# EAGLE board TUTUPA V2.5sch (EAGLE 7.3.0)
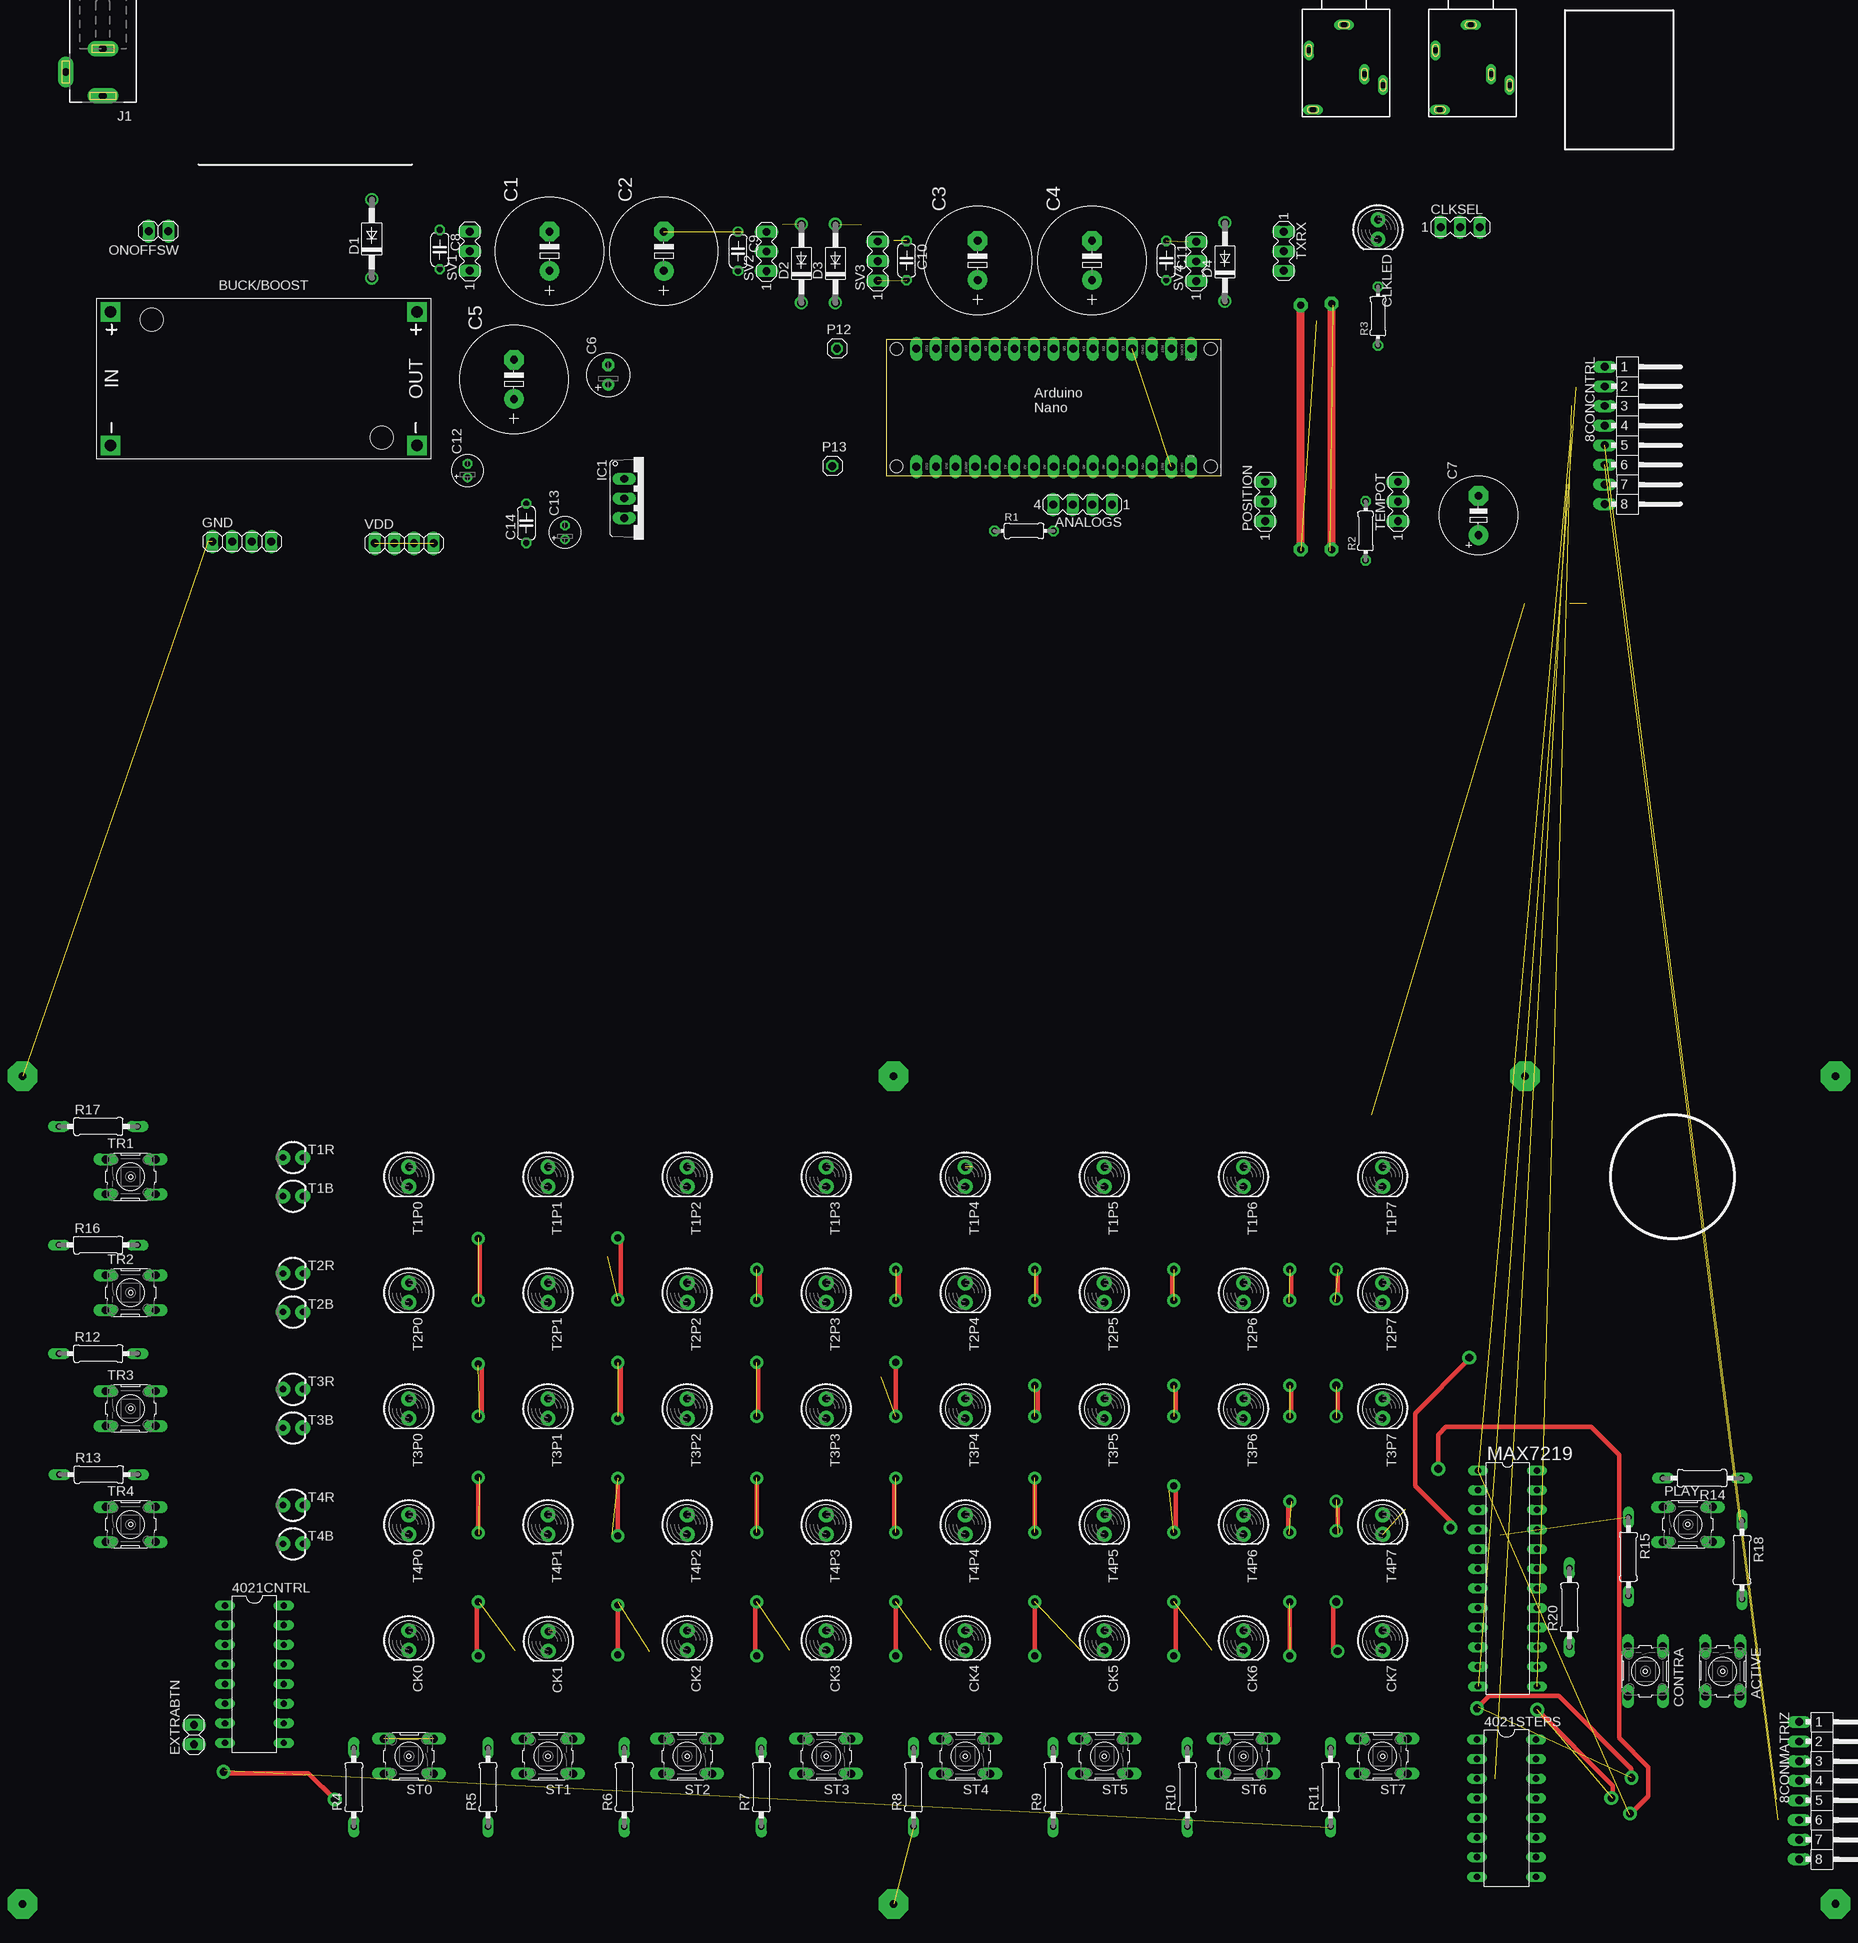
[diagram p2: board, top side]
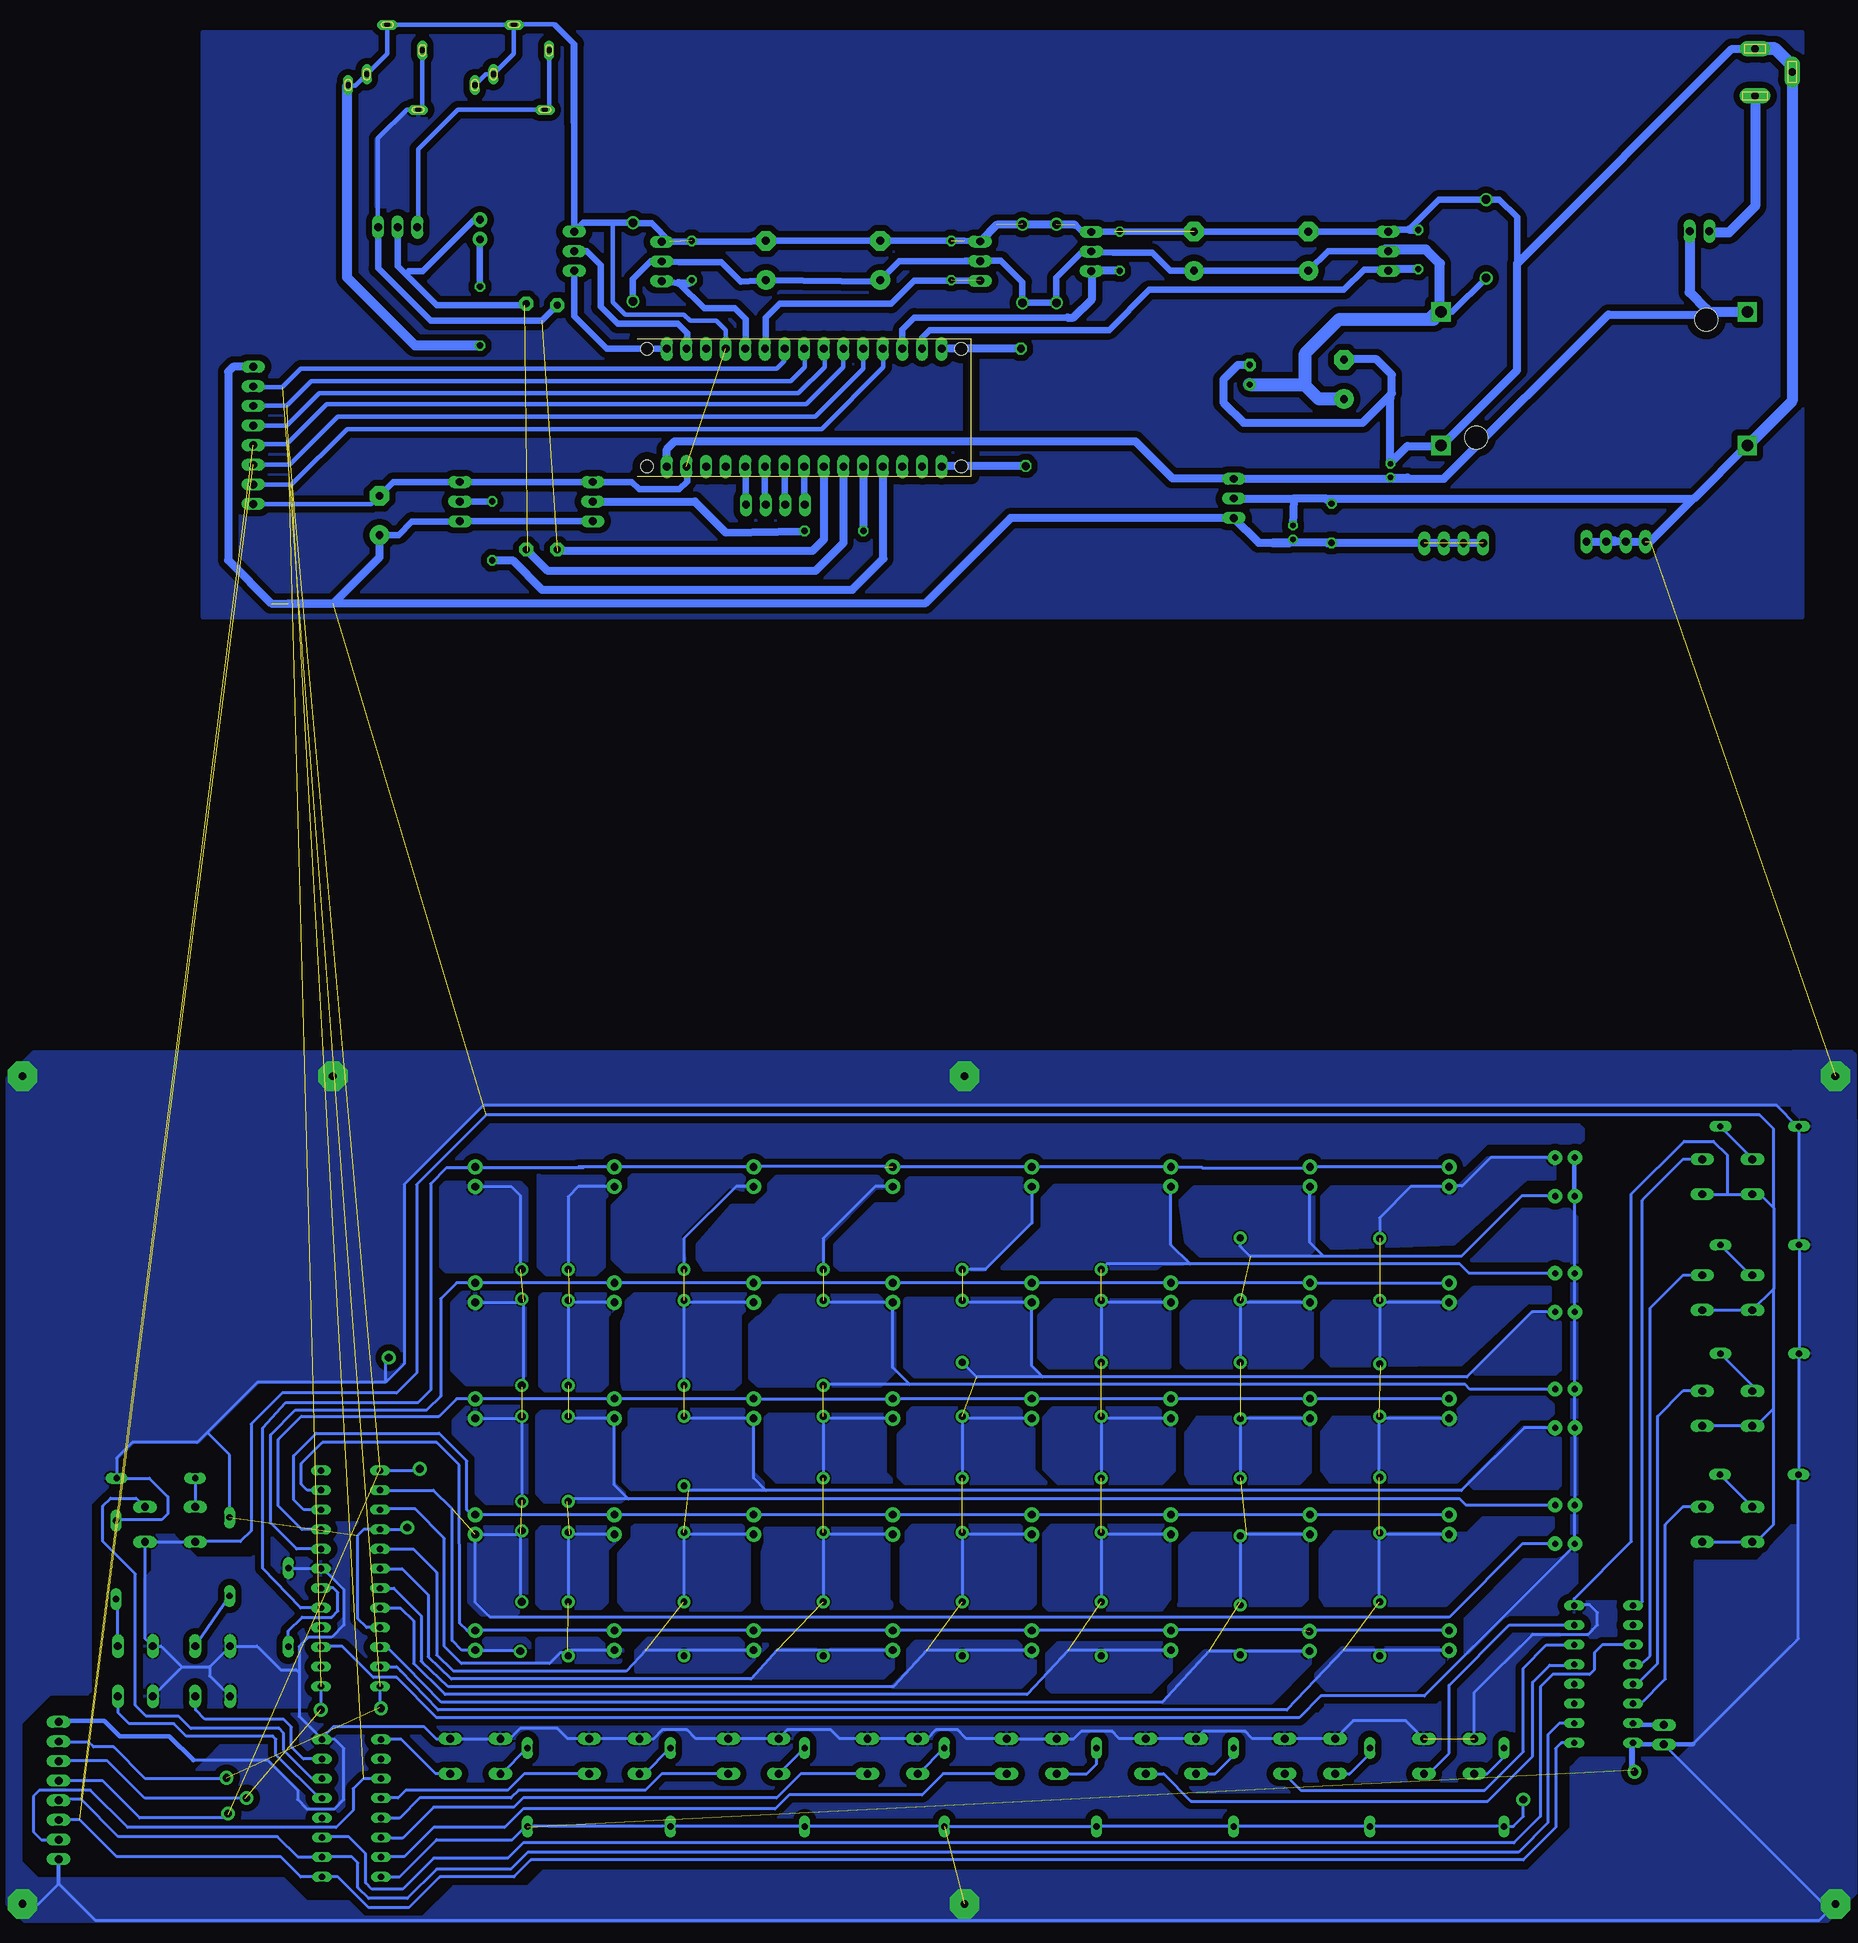
[diagram p3: board, bottom side, seen from below]

Size 43.18 x 17.78 mm. Coordinates in mm from the lower left corner, seen from the top.
Copper layers (1*16): Top 0.035mm / dielectric 1.5mm / Bottom 0.035mm
Design rules "default": minimum track width 10mil, minimum drill 24mil, track to track 8mil, track to pad 8mil, pad to pad 8mil, via to via 8mil, smd to smd 8mil, copper to edge 40mil, drill to drill 8mil, minimum pad ring 10mil, minimum via ring 8mil, stop-mask expansion 4mil, vias tented up to drill 0mil, thermal gap 10mil

## Footprints (pad centres in the part's own frame; a part is rotated, then mirrored left to right if it is on the bottom)
MA08-1W = drill 1.016 long: 1 -8.89,0; 2 -6.35,0; 3 -3.81,0; 4 -1.27,0; 5 1.27,0; 6 3.81,0; 7 6.35,0; 8 8.89,0
DIL16 = drill 0.813 long: 1 -8.89,-3.81; 2 -6.35,-3.81; 3 -3.81,-3.81; 4 -1.27,-3.81; 5 1.27,-3.81; 6 3.81,-3.81; 7 6.35,-3.81; 8 8.89,-3.81; 9 8.89,3.81; 10 6.35,3.81; 11 3.81,3.81; 12 1.27,3.81; 13 -1.27,3.81; 14 -3.81,3.81; 15 -6.35,3.81; 16 -8.89,3.81
B3F-10XX = drill 1.016 long: 1 -3.251,2.261; 2 3.251,2.261; 3 -3.251,-2.261; 4 3.251,-2.261
MA04-1 = drill 1.016 long: 1 -3.81,0; 2 -1.27,0; 3 1.27,0; 4 3.81,0
DC-DC-STEP-DOWN-LM2596 = drill 1.5 pad 2.5 square: IN+ -19.812,8.636; IN- -19.812,-8.636; OUT+ 19.812,8.636; OUT- 19.812,-8.636 | hole 3: -14.478,7.62; 15.24,-7.62
E5-13 = drill 1.016 pad 2.54: + -2.54,0 | drill 1.016 pad 2.54 octagon: - 2.54,0
E2,5-6 = drill 0.813 pad 1.6: + -1.27,0 | drill 0.813 pad 1.6 octagon: - 1.27,0
E5-10,5 = drill 1.016 pad 2.54: + -2.54,0 | drill 1.016 pad 2.54 octagon: - 2.54,0
C050-024X044 = drill 0.813 octagon: 1 -2.54,0; 2 2.54,0
E1,8-4 = drill 0.711 pad 1.168: + -0.889,0 | drill 0.711 pad 1.168 octagon: - 0.889,0
LED5MM = drill 1 pad 1.93: A -1.27,0; K 1.27,0
1503_09 = drill 0.8 pad 1.2 long: 1 0,-2.1; 2 -4.55,-5.4; 3 5.05,-9.9; 4 -4,-13.1; 5 2.65,-8.5
MA03-1 = drill 1.016 long: 1 -2.54,0; 2 0,0; 3 2.54,0
DO41-10 = drill 1.118: A 5.08,0; C -5.08,0
1X02 = drill 1.016 long: 1 -1.27,0; 2 1.27,0
1X04 = drill 1.016 long: 1 -3.81,0; 2 -1.27,0; 3 1.27,0; 4 3.81,0
TO220V = drill 1.016 long: 1 -2.54,-2.54; 2 0,-2.54; 3 2.54,-2.54
DCJ0202 = drill 1 pad 2 long: 1 0,3.1; 2 4.8,0; 3 0,-3
DIL24-3 = drill 0.813 long: 1 -13.97,-3.81; 2 -11.43,-3.81; 3 -8.89,-3.81; 4 -6.35,-3.81; 5 -3.81,-3.81; 6 -1.27,-3.81; 7 1.27,-3.81; 8 3.81,-3.81; 9 6.35,-3.81; 10 8.89,-3.81; 11 11.43,-3.81; 12 13.97,-3.81; 13 13.97,3.81; 14 11.43,3.81; 15 8.89,3.81; 16 6.35,3.81; 17 3.81,3.81; 18 1.27,3.81; 19 -1.27,3.81; 20 -3.81,3.81; 21 -6.35,3.81; 22 -8.89,3.81; 23 -11.43,3.81; 24 -13.97,3.81
1X01 = drill 1.016 octagon: 1 0,0
ARDUINO_NANO = drill 1.016 pad 1.422 long: 3V3 6.35,1.27; 5V 31.75,1.27; A0 11.43,1.27; A1 13.97,1.27; A2 16.51,1.27; A3 19.05,1.27; A4 21.59,1.27; A5 24.13,1.27; A6 26.67,1.27; A7 29.21,1.27; D2 29.21,16.51; D3 26.67,16.51; D4 24.13,16.51; D5 21.59,16.51; D6 19.05,16.51; D7 16.51,16.51; D8 13.97,16.51; D9 11.43,16.51; D10 8.89,16.51; D11 6.35,16.51; D12 3.81,16.51; D13 3.81,1.27; GND 31.75,16.51; GND. 36.83,1.27; REF 8.89,1.27; RST 34.29,16.51; RST. 34.29,1.27; RX1 36.83,16.51; TX1 39.37,16.51; VIN 39.37,1.27 | hole 1.651: 1.27,1.27; 1.27,16.51; 41.91,16.51; 41.91,1.27
0204/7 = drill 0.813 octagon: 1 -3.81,0; 2 3.81,0
0207/10 = drill 0.813 pad 1.422 long: 1 -5.08,0; 2 5.08,0
LED3MM = drill 0.813 pad 1.88: A -1.27,0; K 1.27,0

## Placement (x,y rotation side)
8CONCNTRL  [MA08-1W]  92.89,5.3 270 top  (outside the outline)
8CONMATRIZ  [MA08-1W]  118.07,-170.1 270 top  (outside the outline)
4021CNTRL  4021N  [DIL16]  -81.85,-155.04 270 top  (outside the outline)
4021STEPS  4021N  [DIL16]  80.18,-172.37 270 top  (outside the outline)
ACTIVE  [B3F-10XX]  108.15,-154.66 270 top  (outside the outline)
ANALOGS  [MA04-1]  25.32,-3.66 180 top  (outside the outline)
BUCK/BOOST  DC-DC-STEP-DOWN-LM2596  [DC-DC-STEP-DOWN-LM2596]  -80.63,12.66 0 top  (outside the outline)
C1  1000uf  [E5-13]  -43.65,29.14 90 top  (outside the outline)
C2  1000uF  [E5-13]  -28.85,29.14 90 top  (outside the outline)
C3  1000uF  [E5-13]  11.75,27.94 90 top  (outside the outline)
C4  1000uF  [E5-13]  26.55,27.94 90 top  (outside the outline)
C5  1000uF  [E5-13]  -48.25,12.54 90 top  (outside the outline)
C6  [E2,5-6]  -36.05,13.14 90 top  (outside the outline)
C7  680uF  [E5-10,5]  76.55,-5.06 90 top  (outside the outline)
C8  100nF  [C050-024X044]  -57.85,29.34 270 top  (outside the outline)
C9  100nF  [C050-024X044]  -19.25,29.14 270 top  (outside the outline)
C10  100nF  [C050-024X044]  2.55,27.94 270 top  (outside the outline)
C11  100nF  [C050-024X044]  36.15,27.94 270 top  (outside the outline)
C12  10uF  [E1,8-4]  -54.25,0.74 90 top  (outside the outline)
C13  10uF  [E1,8-4]  -41.65,-7.26 90 top  (outside the outline)
C14  100nF  [C050-024X044]  -46.65,-6.06 90 top  (outside the outline)
CK0  [LED5MM]  -61.85,-150.66 270 top  (outside the outline)
CK1  [LED5MM]  -43.79,-150.78 270 top  (outside the outline)
CK2  [LED5MM]  -25.85,-150.66 270 top  (outside the outline)
CK3  [LED5MM]  -7.85,-150.66 270 top  (outside the outline)
CK4  [LED5MM]  10.15,-150.66 270 top  (outside the outline)
CK5  [LED5MM]  28.15,-150.66 270 top  (outside the outline)
CK6  [LED5MM]  46.15,-150.66 270 top  (outside the outline)
CK7  [LED5MM]  64.15,-150.66 270 top  (outside the outline)
CLKIN  1503_09  [1503_09]  59.15,60.54 0 top  (outside the outline)
CLKLED  [LED5MM]  63.55,31.94 270 top  (outside the outline)
CLKOUT  1503_09  [1503_09]  75.55,60.54 0 top  (outside the outline)
CLKSEL  [MA03-1]  74.19,32.26 0 top  (outside the outline)
CONTRA  [B3F-10XX]  98.15,-154.66 270 top  (outside the outline)
D1  1N4004  [DO41-10]  -66.65,30.74 90 top  (outside the outline)
D2  1N4004  [DO41-10]  -11.05,27.54 90 top  (outside the outline)
D3  1N4004  [DO41-10]  -6.65,27.54 90 top  (outside the outline)
D4  1N4004  [DO41-10]  43.75,27.74 90 top  (outside the outline)
EXTRABTN  [1X02]  -89.65,-162.86 90 top  (outside the outline)
GND  [1X04]  -83.45,-8.46 0 top  (outside the outline)
IC1  7805TV  [TO220V]  -31.45,-2.86 270 top  (outside the outline)
J1  DCJ0202  [DCJ0202]  -101.45,52.34 180 top  (outside the outline)
MAX7219  MAX7219CNG  [DIL24-3]  80.31,-142.65 270 top  (outside the outline)
ONOFFSW  [1X02]  -94.25,31.74 180 top  (outside the outline)
P12  [1X01]  -6.45,16.54 0 top  (outside the outline)
P13  [1X01]  -7.05,1.34 0 top  (outside the outline)
PCB1  ARDUINO_NANO  [ARDUINO_NANO]  0,0 0 top
PLAY  [B3F-10XX]  103.65,-135.66 0 top  (outside the outline)
POSITION  [MA03-1]  48.95,-3.26 90 top  (outside the outline)
R1  220  [0204/7]  17.75,-7.06 0 top  (outside the outline)
R2  220  [0204/7]  61.95,-7.06 90 top  (outside the outline)
R3  330  [0204/7]  63.55,20.74 90 top  (outside the outline)
R4  10k  [0207/10]  -68.97,-169.66 90 top  (outside the outline)
R5  10k  [0207/10]  -51.61,-169.66 90 top  (outside the outline)
R6  10k  [0207/10]  -33.98,-169.66 90 top  (outside the outline)
R7  10k  [0207/10]  -16.24,-169.66 90 top  (outside the outline)
R8  10k  [0207/10]  3.46,-169.66 90 top  (outside the outline)
R9  10k  [0207/10]  21.53,-169.66 90 top  (outside the outline)
R10  10k  [0207/10]  38.9,-169.66 90 top  (outside the outline)
R11  10k  [0207/10]  57.41,-169.66 90 top  (outside the outline)
R12  10k  [0207/10]  -102.04,-113.55 0 top  (outside the outline)
R13  10k  [0207/10]  -101.97,-129.19 0 top  (outside the outline)
R14  10k  [0207/10]  105.48,-129.67 180 top  (outside the outline)
R15  10k  [0207/10]  95.95,-139.83 270 top  (outside the outline)
R16  10k  [0207/10]  -102.05,-99.49 0 top  (outside the outline)
R17  10k  [0207/10]  -102.03,-84.14 0 top  (outside the outline)
R18  10k  [0207/10]  110.65,-140.24 270 top  (outside the outline)
R20  10k  [0207/10]  88.33,-146.4 90 top  (outside the outline)
ST0  [B3F-10XX]  -61.85,-165.66 180 top  (outside the outline)
ST1  [B3F-10XX]  -43.85,-165.66 180 top  (outside the outline)
ST2  [B3F-10XX]  -25.85,-165.66 180 top  (outside the outline)
ST3  [B3F-10XX]  -7.85,-165.66 180 top  (outside the outline)
ST4  [B3F-10XX]  10.15,-165.66 180 top  (outside the outline)
ST5  [B3F-10XX]  28.15,-165.66 180 top  (outside the outline)
ST6  [B3F-10XX]  46.15,-165.66 180 top  (outside the outline)
ST7  [B3F-10XX]  64.15,-165.66 180 top  (outside the outline)
SV1  [MA03-1]  -53.97,29.14 90 top  (outside the outline)
SV2  [MA03-1]  -15.57,29.1 90 top  (outside the outline)
SV3  [MA03-1]  -1.17,27.86 90 top  (outside the outline)
SV4  [MA03-1]  40.03,27.82 90 top  (outside the outline)
T1B  [LED3MM]  -76.85,-93.16 0 top  (outside the outline)
T1P0  [LED5MM]  -61.85,-90.66 270 top  (outside the outline)
T1P1  [LED5MM]  -43.85,-90.66 270 top  (outside the outline)
T1P2  [LED5MM]  -25.85,-90.66 270 top  (outside the outline)
T1P3  [LED5MM]  -7.85,-90.66 270 top  (outside the outline)
T1P4  [LED5MM]  10.15,-90.66 270 top  (outside the outline)
T1P5  [LED5MM]  28.15,-90.66 270 top  (outside the outline)
T1P6  [LED5MM]  46.15,-90.66 270 top  (outside the outline)
T1P7  [LED5MM]  64.15,-90.66 270 top  (outside the outline)
T1R  [LED3MM]  -76.85,-88.16 0 top  (outside the outline)
T2B  [LED3MM]  -76.85,-108.16 0 top  (outside the outline)
T2P0  [LED5MM]  -61.85,-105.66 270 top  (outside the outline)
T2P1  [LED5MM]  -43.85,-105.66 270 top  (outside the outline)
T2P2  [LED5MM]  -25.85,-105.66 270 top  (outside the outline)
T2P3  [LED5MM]  -7.85,-105.66 270 top  (outside the outline)
T2P4  [LED5MM]  10.15,-105.66 270 top  (outside the outline)
T2P5  [LED5MM]  28.15,-105.66 270 top  (outside the outline)
T2P6  [LED5MM]  46.15,-105.66 270 top  (outside the outline)
T2P7  [LED5MM]  64.15,-105.66 270 top  (outside the outline)
T2R  [LED3MM]  -76.85,-103.16 0 top  (outside the outline)
T3B  [LED3MM]  -76.85,-123.16 0 top  (outside the outline)
T3P0  [LED5MM]  -61.85,-120.66 270 top  (outside the outline)
T3P1  [LED5MM]  -43.85,-120.66 270 top  (outside the outline)
T3P2  [LED5MM]  -25.85,-120.66 270 top  (outside the outline)
T3P3  [LED5MM]  -7.85,-120.66 270 top  (outside the outline)
T3P4  [LED5MM]  10.15,-120.66 270 top  (outside the outline)
T3P5  [LED5MM]  28.15,-120.66 270 top  (outside the outline)
T3P6  [LED5MM]  46.15,-120.66 270 top  (outside the outline)
T3P7  [LED5MM]  64.15,-120.66 270 top  (outside the outline)
T3R  [LED3MM]  -76.85,-118.16 0 top  (outside the outline)
T4B  [LED3MM]  -76.85,-138.16 0 top  (outside the outline)
T4P0  [LED5MM]  -61.85,-135.66 270 top  (outside the outline)
T4P1  [LED5MM]  -43.85,-135.66 270 top  (outside the outline)
T4P2  [LED5MM]  -25.85,-135.66 270 top  (outside the outline)
T4P3  [LED5MM]  -7.85,-135.66 270 top  (outside the outline)
T4P4  [LED5MM]  10.15,-135.66 270 top  (outside the outline)
T4P5  [LED5MM]  28.15,-135.66 270 top  (outside the outline)
T4P6  [LED5MM]  46.15,-135.66 270 top  (outside the outline)
T4P7  [LED5MM]  64.15,-135.66 270 top  (outside the outline)
T4R  [LED3MM]  -76.85,-133.16 0 top  (outside the outline)
TEMPOT  [MA03-1]  66.15,-3.26 90 top  (outside the outline)
TR1  [B3F-10XX]  -97.85,-90.66 0 top  (outside the outline)
TR2  [B3F-10XX]  -97.85,-105.66 0 top  (outside the outline)
TR3  [B3F-10XX]  -97.85,-120.66 0 top  (outside the outline)
TR4  [B3F-10XX]  -97.85,-135.66 0 top  (outside the outline)
TXRX  [MA03-1]  51.35,29.14 270 top  (outside the outline)
VDD  [1X04]  -62.45,-8.66 0 top  (outside the outline)

## Tracks (layer width: path | path; a pad name or v marks a point on that pad's centre or on a via)
+5V
  Bottom 0.813: BUCK/BOOST.OUT+ -62.29,21.3 D1.C | SV1.2 -53.45,29.14 -46.19,29.14 C1.+ C2.+ -25.79,26.6 -23.45,28.94 -18.41,28.94 SV2.2 -14.21,28.9 -11.05,25.74 D2.C D3.C -6.65,25.14 -3.85,27.94 0.75,27.94 SV3.2 9.29,27.86 C3.+ 11.95,25.2 C4.+ 29.81,25.2 32.35,27.74 37.75,27.74 SV4.2 41.47,27.82 43.75,25.54 D4.C
  Bottom 1.27: -47.65,20.34 -59.05,20.34 -60.65,21.94 -60.65,27.54 -58.85,29.34 -53.65,29.34 -53.45,29.14
  Bottom 1.676: C5.+ -44.99,10 -43.25,11.74 | -43.25,11.74 -43.25,15.94 -47.65,20.34 -59.86,20.34 BUCK/BOOST.OUT+ | C6.+ -43.12,11.87 -43.25,11.74
+12V
  Bottom 1.016: -56.65,-0.32 IC1.1 -33.93,-0.26 -26.05,-0.26 -21.25,4.54 38.35,4.54 39.37,3.52 PCB1.VIN | -56.65,-0.32 -61.19,-0.32 -82.45,20.94 -94.45,20.94 -95.15,21.64 | C12.+ -56.48,-0.15 -56.65,-0.32
  Bottom 1.27: ONOFFSW.1 -92.98,23.81 -95.15,21.64 -95.45,21.34 -100.4,21.34 BUCK/BOOST.IN+
CLKINARDUINO  (1 unrouted)
  Bottom 0.813: CLKSEL.2 74.19,27.18 73.15,26.14 | 73.15,26.14 69.15,22.14 57.75,22.14 57.55,22.34 | CLKLED.A 64.28,33.21 70.95,26.54 72.75,26.54 73.15,26.14
  Bottom 1.016: PCB1.A2 16.51,-8.62 20.15,-12.26 54.75,-12.26 57.35,-9.66
CLKOUTARDUINO  (1 unrouted)
  Bottom 0.61: CLKOUT.2 71,47.99 CLKOUT.4 73.05,47.44 76.75,43.74 76.75,32.28 CLKSEL.3
  Bottom 0.813: CLKSEL.3 76.73,26.92 69.95,20.14 55.55,20.14 53.35,22.34
  Bottom 1.016: PCB1.A3 19.05,-8.16 20.55,-9.66 53.55,-9.66
  pour Bottom (isolate 0.813): 72.95,35.34 72.95,43.34 70.55,45.74 70.55,46.54 71.15,47.14 73.35,47.14 76.95,43.54 76.95,34.94 73.55,34.94 73.15,35.34
CONIN
  Bottom 0.61: CLKIN.2 54.6,47.99 CLKIN.4 66.45,47.44 71.55,42.34 71.55,32.36 CLKSEL.1
GND  (via drill 1 pad 3.81)  (11 unrouted)
  Bottom 0.406: -93.47,-164.04 -107.05,-150.46 R13.1 -107.12,-129.12 R12.1 R16.1 -107.11,-99.47 R17.1 -106.93,-84.14 -104.25,-81.46 63.15,-81.46 73.35,-91.66 73.35,-114.86 75.75,-117.26 | 75.75,-117.26 92.35,-117.26 98.85,-123.76 | 98.85,-123.76 100.15,-125.06 108.55,-125.06 110.55,-127.06 R14.1 106.34,-129.67 103.95,-132.06 103.95,-134.26 104.75,-135.06 110.55,-135.06 R18.1 | R15.1 95.95,-126.66 98.85,-123.76 | R11.1 R10.1 38.82,-174.66 38.35,-174.66 38.27,-174.74 R9.1 R8.1 R7.1 R6.1 R5.1 R4.1 -70.17,-174.74 -71.45,-173.46 -71.45,-171.26 | MAX7219.9 78.21,-149 79.35,-147.86 79.35,-137.06 78.55,-136.26 76.54,-136.26 MAX7219.4 73.31,-136.3 73.15,-136.46 | 75.75,-117.26 75.75,-114.66 75.35,-114.26 | v122.75,-184.76 120.65,-184.76 118.15,-182.26 118.15,-179.07 8CONMATRIZ.8 118.07,-182.14 113.35,-186.86 -109.76,-186.86 v-111.85,-184.77 -110.29,-184.77 EXTRABTN.1
  Bottom 0.61: CLKIN.1 CLKOUT.1 75.55,54.69 CLKOUT.5 79.7,50.54 80.75,50.54 | CLKIN.1 59.15,54.69 CLKIN.5 62.8,52.04 CLKIN.3 | CLKOUT.3 80.85,50.64 80.95,50.54 80.75,50.54 | 80.55,50.74 80.75,50.54 | 51.55,45.74 51.55,56.14 53.75,58.34 53.95,58.54 59.05,58.54 CLKIN.1 | -93.47,-164.04 -93.38,-164.13 EXTRABTN.1 -85.58,-164.13 -85.45,-164.26 -85.45,-167.26 -85.85,-167.66 | PCB1.GND 31.75,18.94 32.95,20.14 36.35,20.14 37.15,20.94 44.75,20.94 46.35,22.54 46.35,32.62 46.55,32.82 | 8CONCNTRL.8 77.62,-3.59 C7.-
  Bottom 0.813: BUCK/BOOST.OUT- -70.65,13.86 -70.65,33.54 -68.37,35.82 D1.A -60.53,35.82 -56.65,31.94 -54.23,31.94 SV1.3 C1.- -18.61,31.68 SV2.3 -14.55,31.44 -13.45,32.54 | SV3.3 0.91,30.48 C3.- C4.- | 28.15,30.48 C4.- | C4.- 28.43,30.36 SV4.3 38.97,30.36 41.35,32.74 43.67,32.74 D4.A 46.55,32.82 50.21,32.82 TXRX.1 51.35,55.94 53.75,58.34 | C7.- 74.75,-0.72 TEMPOT.3 POSITION.3 43.89,-0.72 42.95,-1.66 37.75,-1.66 36.75,-0.66 36.75,1.19 PCB1.GND.
  Bottom 1.016: IC1.2 -41.76,-2.86 | -45.85,-2.86 -93.45,-2.86 | -93.45,-2.86 -93.56,-2.86 BUCK/BOOST.IN- | C14.2 -46.51,-3.52 -45.85,-2.86 | -45.85,-2.86 -41.76,-2.86 | -41.76,-2.86 C13.- | GND.4 GND.3 | GND.3 -83.25,-8.46 | -93.45,-2.86 -87.85,-8.46 GND.2 -83.25,-8.46 | -83.25,-8.46 -83.05,-8.26 | -83.05,-8.26 -83.25,-8.26 | -83.05,-8.26 -82.38,-8.26 GND.3 | -13.45,32.54 -3.31,32.54 SV3.3 | -56.65,31.94 -57.79,31.94 C8.1 | C6.- -34.52,14.41 -32.65,12.54 -32.65,9.54 -35.25,6.94 -50.65,6.94 -54.05,10.34 | -54.05,10.34 -54.45,10.74 -54.45,13.14 -52.45,15.14 -48.31,15.14 C5.- | -60.73,3.94 -56.45,3.94 -54.25,1.74 | -60.73,3.94 BUCK/BOOST.OUT- | -54.25,1.74 -54.25,10.14 -54.05,10.34 | C12.- -54.25,1.74 | -60.73,3.94 -60.85,3.94 -70.65,13.74 -70.65,27.54 -98.45,55.34 J1.3
  Bottom 1.27: R3.1 71.94,16.93 80.75,25.74 80.75,50.49 CLKOUT.3
  Bottom 1.422: J1.2 -106.25,9.74 -100.05,3.54 -100.05,3.63 BUCK/BOOST.IN-
  Bottom 1.676: J1.2 -106.25,53.14 -104.05,55.34 J1.3
  other vias: -111.83,-77.63 0.86,-184.77 122.75,-77.63 0.86,-77.63 82.59,-77.63
  pour Bottom (isolate 0.813): -107.65,-81.46 63.15,-81.46 73.75,-92.06 73.75,-115.26 75.75,-117.26 92.15,-117.26 99.95,-125.06 108.35,-125.06 110.75,-127.46 110.75,-129.86 113.95,-133.06 113.95,-157.26 114.35,-157.66 119.15,-157.66 122.95,-161.46 122.95,-179.26 120.75,-181.46 88.95,-181.46 85.95,-184.46 80.55,-184.46 78.55,-186.46 70.95,-186.46 66.95,-182.46 57.35,-182.46 55.35,-180.46 -72.05,-180.46 -77.65,-174.86 -77.65,-167.06 -78.85,-165.86 -91.65,-165.86 -107.45,-150.06 -107.45,-83.26 -107.25,-83.06 -114.25,-83.06 -114.45,-83.26 -114.45,-183.46 -110.85,-187.06 122.55,-187.06 124.75,-184.86 124.75,-77.86 121.35,-74.46 -106.05,-74.46 -107.65,-76.06
  pour Bottom (isolate 0.813): -93.65,-140.46 -93.65,-164.26 -97.25,-167.86 -97.25,-163.86 -109.25,-151.86 -109.25,-137.66 -107.45,-135.86 -106.05,-135.86 -101.65,-140.46
  pour Bottom (isolate 0.813): -114.45,-83.06 -114.45,-74.86 -114.05,-74.46 -106.25,-74.46 -106.25,-82.06 -107.05,-82.86 -113.45,-82.86 -113.65,-83.06 -114.25,-83.06
N$2
  Bottom 0.406: ST1.1 -40.6,-168.01 -42.65,-170.06 -66.45,-170.06 -71.45,-165.06 -71.45,-154.26 -74.45,-151.26 -78.01,-151.26 4021CNTRL.14
N$3
  Bottom 0.813: PCB1.A5 24.13,-3.58 ANALOGS.3
N$4
  Bottom 0.813: PCB1.A6 26.67,-3.58 ANALOGS.2
N$5
  Bottom 0.813: ANALOGS.1 29.13,1.19 PCB1.A7
N$6
  Bottom 0.406: ST2.1 -24.91,-167.92 -28.45,-171.46 -66.85,-171.46 -72.65,-165.66 -72.65,-156.06 -74.85,-153.86 -77.95,-153.86 4021CNTRL.13
N$7
  Bottom 0.406: -85.81,-161.5 -85.45,-161.86 -85.45,-161.6 4021CNTRL.7
  Bottom 0.61: EXTRABTN.2 -85.86,-161.59 4021CNTRL.7
N$8
  Bottom 0.406: ST4.2 6.8,-167.92 R8.2
N$9
  Bottom 0.406: ST7.1 69.29,-167.92 73.75,-163.46 76.35,-163.46 4021STEPS.1
N$10
  Bottom 0.406: TR1.1 -101.1,-88.29 R17.2
N$11  (via drill 1 pad 1.68)
  other vias: 58.15,-102.66
N$12
  Bottom 0.406: ST0.1 -59.19,-167.92 -61.85,-165.26 -61.85,-156.46 -69.65,-148.66 -78.01,-148.66 4021CNTRL.15
N$13
  Bottom 0.406: 4021CNTRL.1 -86.36,-146.15 -86.85,-145.66 -86.85,-93.66 -92.11,-88.4 TR1.2
N$14
  Bottom 0.406: 4021CNTRL.4 -86.74,-153.77 -87.85,-152.66 -87.85,-107.66 -90.35,-105.16 -90.85,-104.66 -92.11,-103.4 TR2.2
N$15
  Bottom 0.406: T1R.A T1B.A | T1B.A T2R.A T2B.A T3R.A T3B.A T4R.A T4B.A -78.12,-138.39 -58.65,-157.86 -45.25,-157.86 -42.45,-160.66 69.15,-160.66 74.35,-155.46 77.35,-155.46 81.35,-151.46 84.04,-151.46 MAX7219.15 | T1B.A -77.98,-93.16 -77.98,-88.34
  pour Bottom (isolate 0.813): -75.05,-94.86 -71.25,-94.86 -64.65,-101.46 -77.65,-101.46 -77.65,-138.46 -75.85,-140.26 -71.45,-140.26 -63.85,-147.86 -63.85,-152.26 -64.65,-152.26 -69.65,-147.26 -75.85,-147.26 -78.45,-144.66 -78.45,-95.86 -77.45,-94.86
N$16
  Bottom 0.406: 4021CNTRL.5 -86.2,-156.31 -88.85,-153.66 -88.85,-121.66 -92.11,-118.4 TR3.2
N$17
  Bottom 0.406: R15.2 100.3,-151.3 CONTRA.1
N$18
  Bottom 0.406: 4021STEPS.14 85.25,-168.56 88.95,-164.86 88.95,-162.66 89.55,-162.06 100.95,-162.06 102.55,-160.46 106.75,-160.46 108.15,-159.06 108.15,-142.06 112.35,-137.86 112.35,-133.26 111.35,-132.26 108.04,-132.26 PLAY.2
N$19
  Bottom 0.406: ST4.1 22.01,-167.92 25.15,-171.06 57.95,-171.06 59.15,-172.26 69.55,-172.26 73.55,-176.26 76.29,-176.26 4021STEPS.6
N$20
  Bottom 0.406: ST5.1 40.01,-167.92 42.15,-170.06 58.55,-170.06 59.55,-171.06 71.35,-171.06 73.95,-173.66 76.35,-173.66 4021STEPS.5
N$21
  Bottom 0.406: 4021CNTRL.6 -86.66,-158.85 -89.85,-155.66 -89.85,-135.66 -92.11,-133.4 TR4.2
N$22  (via drill 1 pad 1.78)
  other vias: 76.35,-159.46
N$23  (via drill 1 pad 1.68)
  other vias: 58.15,-106.46
N$24  (via drill 1 pad 1.78)
  Top 0.61: 93.95,-171.06 93.95,-169.46 v84.15,-159.66
N$25
  Bottom 0.406: R14.2 PLAY.1
N$26
  Bottom 0.406: ST0.2 -66.79,-167.92 -69.25,-165.46 -69.25,-163.86 R4.2
N$27
  Bottom 0.406: ST1.2 -48.99,-167.92 -51.65,-165.26 -51.65,-163.42 R5.2
N$28
  Bottom 0.406: ST2.2 -31.59,-167.92 -34.05,-165.46 -34.05,-163.65 R6.2
N$29
  Bottom 0.406: ST3.2 -14.99,-167.92 -16.25,-166.66 -16.25,-164.99 R7.2
N$30
  Bottom 0.406: ST3.1 3.61,-167.92 6.35,-170.66 23.55,-170.66 25.35,-172.46 57.95,-172.46 60.35,-174.86 69.55,-174.86 73.35,-178.66 76.31,-178.66 4021STEPS.7
N$31
  Bottom 0.406: ST5.2 24.87,-167.92 R9.2
N$32
  Bottom 0.406: ST6.2 42.24,-167.92 R10.2
N$33
  Bottom 0.406: ST7.2 60.75,-167.92 R11.2
N$34
  Bottom 0.406: TR4.1 R13.2
N$35
  Bottom 0.406: TR3.1 -101.1,-117.69 R12.2
N$36
  Bottom 0.406: TR2.1 -100.88,-103.4 R16.2
N$37  (via drill 1 pad 1.68)
  other vias: 58.15,-117.66
N$38  (via drill 1 pad 1.68)
  Top 0.61: 58.35,-117.86 58.35,-121.46 v58.15,-121.66
N$39
  Bottom 0.406: ST6.1 57.81,-167.92 59.95,-170.06 73.15,-170.06 74.15,-171.06 76.33,-171.06 4021STEPS.4
N$40
  Bottom 0.406: 4021STEPS.15 86.39,-166.02 87.95,-164.46 87.95,-161.86 88.95,-160.86 99.15,-160.86 100.35,-159.66 100.35,-157.97 CONTRA.2
N$41
  Bottom 0.406: 4021STEPS.13 84.31,-171.1 89.95,-165.46 89.95,-163.46 90.35,-163.06 101.55,-163.06 103.15,-161.46 108.95,-161.46 110.35,-160.06 110.35,-157.97 ACTIVE.2
N$42  (via drill 1 pad 1.68)
  other vias: 58.15,-132.66
N$51  (via drill 0.9 pad 1.68)
  other vias: -52.85,-98.66
N$52  (via drill 0.9 pad 1.68)
  other vias: -52.85,-106.66
N$53
  Bottom 0.406: ACTIVE.1 110.41,-146.2 111.15,-145.46 110.79,-145.46 R18.2
N$54  (via drill 0.9 pad 1.68)
  other vias: -52.85,-114.86
N$55  (via drill 0.9 pad 1.68)
  other vias: -52.85,-121.66
N$56
  Bottom 0.406: 4021CNTRL.3 -81.68,-151.23 -80.65,-152.26 -80.65,-154.46 -80.05,-155.06 -75.25,-155.06 -73.65,-156.66 -73.65,-173.46 -70.25,-176.86 57.95,-176.86 59.95,-178.86 69.55,-178.86 73.55,-182.86 77.55,-182.86 78.35,-182.06 78.35,-178.26 80.55,-176.06 83.87,-176.06 4021STEPS.11
N$57  (1 unrouted)
  Bottom 0.406: 4021STEPS.10 84.55,-178.72 | 84.55,-178.72 87.09,-178.72 89.75,-176.06 110.35,-176.06 115.15,-171.26 117.96,-171.26 8CONMATRIZ.5 | 4021CNTRL.10 -76.12,-161.39 -74.65,-162.86 -74.65,-174.26 -70.85,-178.06 57.35,-178.06 59.55,-180.26 69.15,-180.26 72.95,-184.06 77.95,-184.06 79.35,-182.66 79.35,-179.46 80.15,-178.66 84.49,-178.66 84.55,-178.72
  Bottom 0.61: PCB1.D7 16.55,16.47 16.55,14.14 21.35,9.34 83.35,9.34 88.55,4.14 92.78,4.14 8CONCNTRL.5
N$58  (1 unrouted)
  Bottom 0.406: 4021CNTRL.9 -76.38,-163.93 -75.65,-164.66 -75.65,-174.86 -71.45,-179.06 56.95,-179.06 59.15,-181.26 68.75,-181.26 72.75,-185.26 77.95,-185.26 81.95,-181.26 4021STEPS.9 86.75,-181.26 89.35,-178.66 110.55,-178.66 115.35,-173.86 118.02,-173.86 8CONMATRIZ.6
  Bottom 0.61: PCB1.D8 13.95,16.49 13.95,13.94 20.15,7.74 81.95,7.74 88.15,1.54 92.84,1.54 8CONCNTRL.6
N$59  (2 unrouted)
  Bottom 0.406: 93.75,-171.26 93.92,-171.09 106.92,-171.09 111.75,-166.26 118.04,-166.26 8CONMATRIZ.3 | MAX7219.13 84.12,-159.63 84.15,-159.66
  Bottom 0.61: PCB1.D5 21.55,16.47 21.55,14.14 23.35,12.34 85.35,12.34 88.55,9.14 92.86,9.14 8CONCNTRL.3
N$60  (2 unrouted)
  Bottom 0.406: MAX7219.1 71.57,-128.68 71.35,-128.46 | 96.15,-173.63 96.15,-173.26 96.52,-173.63 107.58,-173.63 112.35,-168.86 118.04,-168.86 8CONMATRIZ.4
  Bottom 0.61: PCB1.D6 18.95,16.41 18.95,14.14 22.35,10.74 84.35,10.74 88.55,6.54 92.86,6.54 8CONCNTRL.4
N$61  (via drill 0.9 pad 1.78)
  other vias: 53.55,-9.46
N$62  (via drill 0.9 pad 1.68)
  other vias: -52.85,-129.56
N$63  (1 unrouted)
  Bottom 0.406: 4021STEPS.3 78.65,-168.56 79.95,-169.86 79.95,-172.66 82.15,-174.86 109.15,-174.86 113.95,-170.06 120.55,-170.06 121.35,-170.86 121.35,-175.46 120.35,-176.46 8CONMATRIZ.7
  Bottom 0.61: PCB1.D9 11.35,16.43 11.35,14.14 19.35,6.14 80.75,6.14 87.95,-1.06 8CONCNTRL.7
N$64  (2 unrouted)
  Bottom 0.406: 96.35,-168.46 96.44,-168.55 106.86,-168.55 110.95,-164.46 113.55,-164.46 114.15,-163.86 117.96,-163.86 8CONMATRIZ.2 | MAX7219.12 76.5,-159.31 76.35,-159.46
  Bottom 0.61: PCB1.D4 24.15,16.49 24.15,14.94 25.15,13.94 86.75,13.94 89.15,11.54 92.78,11.54 8CONCNTRL.2
N$65  (via drill 0.9 pad 1.68)
  other vias: -52.85,-136.76
N$66
  Bottom 0.406: R20.1 88.33,-149.44 86.55,-147.66 82.75,-147.66 81.95,-146.86 81.95,-144.46 82.55,-143.86 84.06,-143.86 MAX7219.18
N$67  (via drill 0.9 pad 1.68)
  other vias: -52.85,-145.66
N$68  (1 unrouted)
  Bottom 0.406: CK0.A -43.14,-149.39 -43.14,-149.32 -25.85,-149.32 CK2.A CK3.A CK4.A CK5.A | CK5.A 28.72,-149.39 28.72,-149.5 | CK5.A CK6.A CK7.A 65.22,-149.39 66.15,-148.46 66.25,-127.96 69.15,-125.06 83.95,-125.06 86.65,-127.76 86.65,-130.46 85.89,-131.22 MAX7219.23
N$69
  Bottom 0.813: R2.2 TEMPOT.2
N$70
  Bottom 1.016: POSITION.2 35.75,-3.26 31.75,-7.26 R1.2
N$71
  Bottom 0.813: PCB1.A4 21.59,-3.58 ANALOGS.4
N$72
  Bottom 1.27: J1.1 -101.45,34.94 -98.05,31.54 -95.72,31.54 ONOFFSW.2
N$73  (via drill 0.9 pad 1.78)
  other vias: 57.55,-9.46
N$74  (via drill 0.9 pad 1.78)
  Top 1.016: 53.35,-9.66 53.55,-9.66 v53.55,22.14
N$75  (via drill 0.9 pad 1.78)
  Top 1.016: 57.35,-9.66 57.55,-9.66 v57.55,22.34
N$76
  Bottom 1.016: PCB1.A1 13.97,-7.03 R1.1
N$77
  Bottom 1.016: PCB1.A0 11.35,1.19 11.35,-10.66 15.35,-14.66 55.55,-14.66 59.34,-10.87 R2.1
N$78
  Bottom 0.406: T3P0.A T3P1.A T3P2.A T3P3.A T3P4.A T3P5.A T3P6.A T3P7.A 66.58,-119.39 68.85,-121.66 86.65,-121.66 89.65,-124.66 89.65,-133.26 86.61,-136.3 MAX7219.21
N$79
  Bottom 0.406: T4P0.A T4P1.A T4P2.A T4P3.A T4P4.A T4P5.A T4P6.A T4P7.A 64.62,-134.39 65.25,-133.76 65.25,-127.46 68.85,-123.86 84.75,-123.86 87.65,-126.76 87.65,-132.46 86.35,-133.76 MAX7219.22
N$80  (via drill 0.9 pad 1.68)
  other vias: -52.85,-152.66
N$81  (4 unrouted)
  Bottom 0.406: CK0.K -48.18,-151.93 -40.85,-159.66 68.95,-159.66 73.8,-154.62 | 73.8,-154.62 74.15,-154.26 | MAX7219.11 74.34,-154.08 73.8,-154.62 | T1R.K -67.25,-88.16 -63.55,-91.86 -61.92,-91.86 T1P0.K -56.88,-91.93 -52.85,-95.96 -52.85,-98.56 | T2P0.K -53.02,-106.93 -52.85,-106.76 -52.85,-114.96 -52.95,-115.06 | T3P0.K -52.92,-121.93 -52.75,-121.76 -52.75,-129.56 | T4P0.K -52.78,-136.93 -52.75,-136.96 -52.75,-145.76
  pour Bottom: -75.25,-88.26 -66.85,-88.26 -63.05,-92.06 -46.65,-92.06 -45.45,-93.26 -45.45,-98.66 -46.65,-99.86 -62.45,-99.26 -71.85,-90.86 -75.45,-90.86 -75.45,-88.46
  pour Bottom: -74.85,-105.06 -65.05,-105.06 -63.25,-106.86 -46.85,-106.86 -45.45,-108.26 -45.45,-113.86 -46.65,-115.06 -63.45,-114.86 -72.05,-106.86 -74.65,-106.86 -74.85,-106.66
  pour Bottom: -62.05,-121.86 -46.85,-121.86 -45.45,-123.66 -45.45,-128.66 -46.45,-130.06 -62.85,-130.06 -71.05,-121.86 -74.65,-121.86 -75.25,-121.26 -75.25,-120.26 -74.25,-119.26 -64.65,-119.26
  pour Bottom: -52.65,-136.66 -47.05,-136.66 -45.25,-138.86 -45.25,-145.06 -45.85,-146.06 -61.45,-146.06 -70.65,-136.86 -74.45,-136.86 -75.25,-136.06 -75.25,-134.86 -66.25,-134.86 -64.25,-136.86 -52.45,-136.86
  pour Bottom: -61.45,-151.66 -48.05,-151.66 -44.65,-155.06 -44.65,-155.66 -46.05,-157.06 -57.45,-157.06 -62.05,-152.46 -62.05,-152.26 -61.65,-151.86
N$82  (4 unrouted)
  Bottom 0.406: -43.88,-91.96 T1P1.K -43.85,-99.16 -45.65,-100.96 | CK1.K -30.76,-152.05 -24.75,-158.66 68.55,-158.66 73.15,-153.96 75.57,-151.54 MAX7219.10 | T1B.K -71.25,-93.16 -63.45,-100.96 -45.65,-100.96 | -45.65,-100.96 -36.15,-100.96 -34.85,-99.66 -34.85,-99.26 | T2P1.K -35.12,-106.93 -34.85,-106.66 -34.85,-114.66 | T3P1.K -35.12,-121.93 -34.85,-121.66 -34.85,-129.66 | T4P1.K -35.58,-136.93 -34.85,-137.66 -34.85,-145.66
  pour Bottom: -43.85,-136.86 -28.65,-136.86 -27.05,-138.46 -27.05,-145.86 -26.85,-146.06 -42.65,-146.06 -43.45,-145.26 -43.45,-137.26
  pour Bottom: -43.65,-121.86 -29.25,-121.86 -27.85,-123.86 -27.85,-129.06 -28.45,-130.26 -42.45,-130.26 -43.85,-128.86 -43.85,-122.46
  pour Bottom: -43.85,-106.86 -28.65,-106.86 -27.25,-108.26 -27.25,-114.66 -27.85,-115.26 -42.85,-115.26 -44.05,-114.06 -44.05,-107.46
  pour Bottom: -43.85,-92.06 -28.85,-92.06 -27.05,-93.86 -27.85,-99.06 -29.65,-100.86 -43.45,-100.86 -44.25,-100.06 -44.25,-92.86 -43.65,-92.26
  pour Bottom: -44.05,-152.06 -30.25,-152.06 -25.65,-156.66 -25.65,-157.86 -24.85,-158.66 -38.85,-158.66 -43.85,-153.66
N$83  (4 unrouted)
  Bottom 0.406: CK2.K -12.58,-151.93 -7.25,-157.66 68.05,-157.66 72.15,-153.66 72.15,-148.16 73.85,-146.46 MAX7219.8 | T2R.K -64.45,-103.16 -63.25,-101.96 -28.35,-101.96 | -28.35,-101.96 -25.85,-99.46 T1P2.K | -28.35,-101.96 -17.55,-101.96 -16.85,-102.66 | T2P2.K -17.12,-106.93 -16.85,-106.66 -16.85,-114.66 | T3P2.K -17.12,-121.93 -16.85,-121.66 -16.85,-129.66 | T4P2.K -17.12,-136.93 -16.85,-136.66 -16.85,-145.66
  pour Bottom: -25.85,-152.06 -25.85,-154.66 -23.25,-157.26 -10.45,-157.26 -9.85,-156.66 -9.85,-152.46 -11.25,-151.06 -25.05,-151.06 -25.85,-151.86
  pour Bottom: -9.45,-136.86 -9.45,-146.06 -10.05,-146.66 -24.65,-146.66 -25.65,-145.26 -25.65,-136.86 -25.05,-135.86 -10.45,-135.86
  pour Bottom: -9.45,-121.86 -9.45,-128.46 -11.25,-130.26 -24.65,-130.26 -26.25,-128.66 -26.25,-122.86 -24.05,-120.66 -10.65,-120.66
  pour Bottom: -25.65,-107.06 -25.65,-115.26 -10.05,-115.26 -8.85,-114.06 -8.85,-108.66 -10.85,-106.66 -25.25,-106.66
  pour Bottom: -25.65,-91.86 -10.85,-91.86 -9.25,-93.46 -9.25,-97.26 -4.05,-102.46 -24.05,-102.46 -24.65,-101.86 -27.45,-101.86 -27.85,-101.46 -27.65,-101.46 -25.65,-99.46
N$84  (4 unrouted)
  Bottom 0.406: CK3.K 5.72,-151.93 10.05,-156.66 67.65,-156.66 71,-153.5 | 71,-153.5 71.15,-153.36 | MAX7219.7 74.69,-143.92 71.15,-147.46 71.15,-153.35 71,-153.5 | T2B.K -72.55,-108.16 -64.15,-116.56 -9.25,-116.56 | -9.25,-116.56 -7.85,-115.16 T2P3.K 0.88,-106.93 1.15,-106.66 | T1P3.K -7.85,-96.66 -1.85,-102.66 1.15,-102.66 | T3P3.K 0.88,-121.93 1.15,-121.66 1.15,-129.66 | T4P3.K 0.88,-136.93 1.15,-136.66 1.15,-145.66 | -9.25,-116.56 -0.75,-116.56 1.15,-114.66
  pour Bottom: 8.15,-151.86 8.15,-154.66 10.15,-156.66 -6.45,-156.66 -8.25,-154.86 -8.25,-153.26 -5.85,-150.86 7.15,-150.86
  pour Bottom: 8.35,-136.66 8.35,-138.06 8.95,-138.66 8.95,-145.66 8.15,-146.46 -7.65,-146.46 -8.25,-145.86 -8.25,-137.86 -6.25,-135.86 7.55,-135.86
  pour Bottom: 8.55,-106.66 8.55,-115.26 7.35,-116.46 -8.65,-116.46 -8.85,-116.26 -7.65,-115.06 -7.65,-107.06 -7.05,-106.46 8.35,-106.46
  pour Bottom: 8.35,-91.26 8.35,-93.06 9.55,-94.26 12.35,-94.26 17.55,-99.46 17.55,-102.06 16.95,-102.66 -1.65,-102.66 -7.65,-96.66 -7.65,-92.06 -6.45,-90.86 7.95,-90.86
  pour Bottom: 8.15,-121.46 8.15,-122.86 9.35,-124.06 9.35,-129.46 8.55,-130.26 -9.65,-130.26 -8.05,-128.66 -8.05,-122.66 -6.05,-120.66 7.55,-120.66 8.15,-121.26
  pour Bottom (isolate 0.813): -75.65,-116.26 -65.25,-116.26 -64.85,-115.86 -72.45,-108.26 -75.05,-108.26 -76.25,-109.46 -76.25,-115.66
N$85  (4 unrouted)
  Bottom 0.406: CK4.K 25.12,-151.93 28.45,-155.66 67.25,-155.66 70.15,-152.86 70.25,-152.76 70.25,-144.76 73.63,-141.38 MAX7219.6 | T3R.K -64.55,-118.16 -63.95,-117.56 7.95,-117.56 | 7.95,-117.56 10.15,-115.36 T2P4.K 18.88,-106.93 19.15,-106.66 | T1P4.K 12.42,-91.93 19.15,-98.66 19.15,-102.66 | 7.95,-117.56 19.05,-117.56 19.15,-117.66 | T3P4.K 18.88,-121.93 19.15,-121.66 19.15,-129.66 | T4P4.K 18.88,-136.93 19.15,-136.66 19.15,-145.66
  pour Bottom: 10.35,-151.86 24.55,-151.86 28.15,-155.46 11.35,-155.46 10.15,-154.26 10.15,-152.26
  pour Bottom: 26.55,-136.46 26.55,-138.06 26.95,-139.26 26.95,-145.66 26.55,-146.46 10.55,-146.46 10.35,-146.26 10.35,-145.86 10.75,-145.46 10.75,-137.06 11.55,-136.26 26.55,-136.26 26.75,-136.46 26.75,-136.66
  pour Bottom: 26.55,-121.86 26.55,-128.66 25.15,-130.06 10.35,-130.06 10.35,-129.86 11.15,-129.06 11.15,-122.26 10.35,-121.46 26.15,-121.46
  pour Bottom: 26.15,-91.66 26.15,-92.66 27.95,-94.46 30.95,-94.46 35.35,-99.46 35.35,-101.26 34.55,-102.66 19.75,-102.66 19.35,-102.26 19.35,-99.06 12.35,-92.06 10.35,-92.06 10.35,-91.26 11.55,-91.26 12.15,-90.66 25.15,-90.66
  pour Bottom: 25.55,-106.86 25.55,-107.06 27.35,-108.86 27.55,-108.86 28.55,-109.86 28.55,-116.66 27.55,-117.66 11.75,-117.66 9.95,-115.86 9.95,-108.26 12.15,-106.06 24.75,-106.06
N$86  (4 unrouted)
  Bottom 0.406: CK5.K 42.12,-151.93 44.65,-154.66 66.95,-154.66 69.15,-152.56 69.15,-141.86 72.17,-138.84 MAX7219.5 | T3B.K -71.55,-123.16 -63.45,-131.26 26.55,-131.26 | 26.55,-131.26 28.15,-129.66 T3P5.K 36.88,-121.93 37.15,-121.66 | T1P5.K 30.42,-91.93 37.15,-98.66 37.15,-102.66 | T2P5.K 36.88,-106.93 37.15,-106.66 37.15,-117.66 | 26.55,-131.26 36.55,-131.26 37.15,-130.66 | T4P5.K 36.88,-136.93 37.15,-136.66 37.15,-145.66
  pour Bottom: 43.35,-154.66 29.75,-154.66 26.35,-151.26 29.35,-151.26 30.15,-150.46 41.75,-150.46 43.35,-152.06
  pour Bottom: 43.75,-136.06 43.75,-137.46 45.55,-139.46 45.55,-145.66 44.75,-146.66 29.75,-146.66 28.75,-145.66 28.75,-136.86 29.75,-135.86 43.55,-135.86
  pour Bottom: 44.15,-121.06 44.15,-123.06 44.95,-123.86 44.95,-130.06 43.95,-131.06 27.15,-131.06 26.95,-131.26 26.95,-130.26 28.55,-128.66 28.55,-121.86 29.55,-120.86 43.95,-120.86
  pour Bottom: 44.55,-106.86 44.55,-108.26 45.15,-109.66 45.15,-117.06 44.95,-118.06 30.75,-118.06 29.95,-117.26 29.95,-108.46 28.15,-106.66 28.95,-105.86 43.55,-105.86
  pour Bottom: 44.15,-90.86 44.15,-92.26 46.35,-94.46 46.35,-101.26 44.75,-102.86 37.75,-102.86 36.95,-102.06 37.75,-98.26 31.35,-91.86 28.95,-92.46 28.35,-91.86 28.35,-91.26 28.95,-91.26 29.75,-90.46 43.75,-90.46
  pour Bottom (isolate 0.813): -75.85,-131.06 -65.05,-131.06 -64.45,-130.46 -64.45,-130.06 -71.45,-123.06 -74.85,-123.06 -76.25,-124.46 -76.25,-130.66
N$87  (4 unrouted)
  Bottom 0.406: T4R.K -64.05,-133.16 -63.25,-132.36 44.35,-132.36 | 44.35,-132.36 46.15,-130.56 T3P6.K 52.08,-121.93 52.15,-121.86 | T1P6.K 50.82,-91.93 52.15,-93.26 52.15,-102.66 | T2P6.K 52.02,-106.93 52.15,-107.06 52.15,-117.66 | 44.35,-132.36 52.05,-132.36 52.35,-132.66 | T4P6.K 52.02,-136.93 52.15,-137.06 52.15,-145.86 | CK6.K 52.22,-151.93 52.55,-152.26 53.15,-152.26 54.55,-153.66 65.95,-153.66 68.15,-151.46 68.15,-137.46 71.95,-133.66 76.4,-133.66 MAX7219.3
  pour Bottom: 55.95,-90.46 55.95,-102.26 54.95,-103.26 48.55,-103.26 47.55,-102.26 47.55,-93.46 45.95,-91.86 46.55,-91.86 47.75,-90.66 55.75,-90.66
  pour Bottom: 56.15,-150.66 56.15,-153.26 55.95,-153.46 45.55,-153.46 45.15,-153.06 45.15,-151.86 45.55,-151.46 47.35,-151.46 48.35,-150.46 55.95,-150.46
  pour Bottom: 56.15,-122.66 56.15,-131.66 55.15,-132.66 45.35,-132.66 44.95,-132.26 44.95,-131.66 46.35,-130.26 46.35,-121.86 47.15,-121.06 55.55,-121.06 56.15,-121.66 56.15,-122.46
  pour Bottom: 55.75,-106.86 55.75,-117.66 55.15,-118.26 47.95,-118.26 47.15,-117.46 47.15,-108.66 46.15,-107.66 46.15,-106.66 46.55,-106.66 47.35,-105.86 55.35,-105.86 55.75,-106.26 55.75,-106.66
  pour Bottom: 56.15,-136.66 56.15,-145.86 55.55,-146.46 47.95,-146.46 47.15,-145.66 47.15,-138.86 45.55,-137.26 45.55,-137.06 46.55,-136.06 55.55,-136.06
N$88  (4 unrouted)
  Bottom 0.406: T4B.K -71.35,-138.16 -61.85,-147.66 62.25,-147.66 64.15,-145.76 T4P7.K 58.42,-136.93 58.35,-136.86 58.35,-145.66 58.55,-145.86 | MAX7219.2 69.59,-131.22 67.15,-133.66 67.15,-150.66 65.88,-151.93 CK7.K 59.08,-151.93 | T1P7.K 59.48,-91.93 58.35,-93.06 58.35,-102.66 | T2P7.K 58.02,-106.93 57.95,-106.86 57.95,-117.66 58.15,-117.86 | T3P7.K 58.22,-121.93 58.15,-121.86 58.15,-132.46
  pour Bottom: 57.75,-150.46 62.75,-150.46 64.15,-151.86 57.35,-151.86 57.15,-151.66 57.15,-151.06
  pour Bottom: 57.55,-139.26 57.55,-145.86 58.95,-147.26 63.35,-147.26 64.95,-145.66 64.95,-138.06 62.95,-136.06 58.95,-136.06 57.55,-137.46
  pour Bottom: 66.95,-123.86 63.95,-126.86 63.95,-131.66 62.75,-132.86 58.35,-132.86 57.55,-132.06 57.55,-121.46 58.55,-120.46 65.15,-120.46 66.95,-122.26
  pour Bottom: 67.15,-107.06 67.15,-115.66 65.35,-117.46 58.35,-117.46 57.75,-116.46 57.75,-107.06 58.35,-105.66 65.75,-105.66
  pour Bottom: 68.55,-92.06 68.55,-102.26 67.95,-102.86 58.75,-102.86 57.55,-101.66 57.55,-92.26 58.35,-91.46 67.95,-91.46
N$89  (via drill 0.9 pad 1.68)
  other vias: -34.85,-98.56
N$90  (via drill 0.9 pad 1.68)
  other vias: -34.85,-106.59
N$91  (via drill 0.9 pad 1.68)
  other vias: -34.85,-114.66
N$92  (via drill 0.9 pad 1.68)
  other vias: -34.85,-121.96
N$93  (via drill 0.9 pad 1.68)
  other vias: -34.85,-137.16
N$94  (via drill 0.9 pad 1.68)
  other vias: -34.85,-146.09
N$95  (via drill 0.9 pad 1.68)
  other vias: -34.85,-152.56
N$96  (via drill 0.9 pad 1.68)
  other vias: -34.85,-129.66
N$97  (via drill 0.9 pad 1.68)
  other vias: -16.85,-102.66
N$98  (via drill 0.9 pad 1.68)
  other vias: -16.85,-114.66
N$99  (via drill 0.9 pad 1.68)
  other vias: -16.85,-106.66
N$100  (1 unrouted)
  Bottom 0.406: T1P0.A T1P1.A | T1P1.A -43.09,-89.39 | -43.09,-89.39 -43.09,-89.13 -43.85,-89.13 T1P1.A | -43.09,-89.39 -43.09,-89.5 -29.9,-89.5 -29.9,-89.39 T1P2.A T1P3.A 11.11,-89.39 11.11,-89.32 28.15,-89.32 T1P5.A T1P6.A | T1P6.A 50.13,-89.39 50.13,-89.5 50.85,-89.5 | 50.85,-89.5 64.77,-89.5 | 64.77,-89.5 64.77,-89.13 64.15,-89.13 T1P7.A | T1P6.A 50.85,-89.39 50.85,-89.5 | 64.77,-89.5 67.89,-89.5 69.95,-91.56 69.95,-118.26 71.55,-119.86 88.65,-119.86 91.65,-123.16 91.65,-141.36 86.75,-146.46 MAX7219.17
N$101
  Bottom 0.406: T2P0.A T2P1.A T2P2.A | T2P2.A -25.35,-104.39 -25.35,-104.6 -25.85,-104.6 T2P2.A | T2P2.A T2P3.A T2P4.A T2P5.A T2P6.A T2P7.A 66.58,-104.39 68.65,-106.46 68.65,-119.06 70.45,-120.86 87.45,-120.86 90.65,-124.06 90.65,-135.46 87.27,-138.84 MAX7219.20
N$102  (via drill 0.9 pad 1.68)
  other vias: -16.85,-121.66
N$103  (via drill 0.9 pad 1.68)
  other vias: -16.85,-136.66
N$104  (via drill 0.9 pad 1.68)
  other vias: -16.85,-145.66
N$105  (via drill 0.9 pad 1.68)
  other vias: -16.85,-152.66
N$106  (via drill 0.9 pad 1.68)
  Top 0.61: 1.15,-145.46 v1.15,-152.66
N$107  (via drill 0.9 pad 1.68)
  other vias: 19.15,-152.66
N$108  (via drill 0.9 pad 1.68)
  other vias: 37.15,-152.66
N$109  (via drill 0.9 pad 1.68)
  other vias: 52.15,-152.66
N$110  (via drill 0.9 pad 1.68)
  Top 0.61: v-16.85,-129.66 -16.85,-136.86
N$111  (via drill 0.9 pad 1.68)
  other vias: 1.15,-102.66
N$112  (via drill 0.9 pad 1.68)
  Top 0.61: 1.55,-102.66 1.55,-106.26 v1.15,-106.66
N$113  (via drill 0.9 pad 1.68)
  Top 0.61: v1.15,-114.66 1.15,-121.86 0.95,-122.06
N$114  (via drill 0.9 pad 1.68)
  other vias: 1.15,-121.66
N$115  (via drill 0.9 pad 1.68)
  other vias: 1.15,-129.66
N$116  (via drill 0.9 pad 1.68)
  other vias: 1.15,-136.66
N$117  (via drill 0.9 pad 1.68)
  other vias: 1.15,-145.66
N$118  (via drill 0.9 pad 1.68)
  other vias: 19.15,-102.66
N$119  (via drill 0.9 pad 1.68)
  other vias: 19.15,-106.66
N$120  (via drill 0.9 pad 1.68)
  other vias: 19.15,-117.66
N$121  (via drill 0.9 pad 1.68)
  Top 0.61: 19.55,-117.66 19.55,-121.26 v19.15,-121.66
N$122  (via drill 0.9 pad 1.68)
  Top 0.61: v19.15,-129.66 19.15,-136.86
N$123  (via drill 0.9 pad 1.68)
  other vias: 19.15,-136.66
N$124  (via drill 0.9 pad 1.68)
  other vias: 19.15,-145.66
N$125  (via drill 0.9 pad 1.68)
  other vias: 37.15,-102.66
N$126  (via drill 0.9 pad 1.68)
  Top 0.61: 36.95,-102.66 36.95,-106.46 v37.15,-106.66
N$127  (via drill 0.9 pad 1.68)
  other vias: 37.15,-117.66
N$128  (via drill 0.9 pad 1.68)
  other vias: 37.15,-121.66
N$129  (via drill 0.9 pad 1.68)
  other vias: 37.15,-130.66
N$130  (via drill 0.9 pad 1.68)
  other vias: 37.15,-136.66
N$131  (via drill 0.9 pad 1.68)
  other vias: 37.15,-145.66
N$132  (via drill 0.9 pad 1.68)
  Top 0.61: v52.15,-145.66 52.15,-152.66 51.95,-152.86
N$133  (via drill 0.9 pad 1.68)
  other vias: 52.15,-136.66
N$134  (via drill 0.9 pad 1.68)
  other vias: 52.15,-121.66
N$135  (via drill 0.9 pad 1.68)
  other vias: 52.15,-117.66
N$136  (via drill 0.9 pad 1.68)
  other vias: 52.15,-106.66
N$137  (via drill 0.9 pad 1.68)
  other vias: 52.15,-102.66
N$138  (via drill 0.9 pad 1.68)
  other vias: 52.15,-132.66
N$139  (via drill 1 pad 1.68)
  other vias: 58.15,-136.46
N$140  (via drill 1 pad 1.68)
  other vias: 58.15,-145.66
N$141  (via drill 1 pad 1.68)
  other vias: 58.35,-152.06
N$142
  Bottom 0.813: TXRX.3 51.35,20.74 47.15,16.54 39.4,16.54 PCB1.TX1
N$143
  Bottom 0.813: TXRX.2 49.75,29.14 47.95,27.34 47.95,21.94 45.75,19.74 37.95,19.74 36.75,18.54 36.75,16.59 PCB1.RX1
N$144  (via drill 1 pad 1.78)
  Top 0.61: v71.35,-128.46 71.35,-124.06 72.35,-123.06 91.15,-123.06 94.75,-126.66 94.75,-163.26 98.55,-167.06 98.55,-170.86 96.35,-173.06
N$145  (via drill 1 pad 1.78)
  Top 0.61: v96.35,-168.46 96.35,-167.26 86.95,-157.86 77.95,-157.86 76.55,-159.26
N$146  (via drill 1 pad 1.78)
  other vias: 93.75,-171.06
N$147  (via drill 1 pad 1.78)
  other vias: 96.15,-173.06
N$148  (via drill 1 pad 1.78)
  other vias: 72.95,-136.06
N$149  (via drill 1 pad 1.78)
  other vias: 75.35,-114.06
N$150  (via drill 1 pad 1.78)
  other vias: -85.85,-167.66
N$151  (via drill 1 pad 1.78)
  Top 0.61: -85.85,-167.86 -74.85,-167.86 v-71.45,-171.26
N$152
  Bottom 0.406: 67.75,-163.46 69.15,-163.46 70.75,-161.86 82.55,-161.86 84.15,-163.46
N$154
  Bottom 0.813: R3.2 CLKLED.K
N$155
  Bottom 1.016: P12.1 3.78,16.54 PCB1.D12
N$156
  Bottom 1.016: P13.1 3.74,1.34 PCB1.D13
N$157
  Top 0.61: -52.65,-98.66 -52.65,-106.46
N$158
  Bottom 0.813: PCB1.D11 6.35,17.94 5.35,18.94 -17.85,18.94 -23.05,24.14 -48.25,24.14 -50.85,26.74 -53.83,26.74 SV1.1
  Bottom 1.016: C8.2 -54.17,26.8 SV1.1
N$159
  Top 0.61: -34.45,-98.66 -34.45,-106.66
N$160
  Top 0.61: -52.45,-115.06 -52.45,-121.46 -52.85,-121.86
N$161
  Bottom 0.813: PCB1.D10 8.89,19 7.35,20.54 -12.45,20.54
  Bottom 1.016: -12.45,20.54 -13.25,20.54 -15.65,22.94 -15.65,26.48 SV2.1 -15.61,26.6 C9.2
N$162
  Top 0.61: -34.45,-115.06 -34.45,-121.86 -34.85,-122.26
N$163
  Top 0.61: -52.85,-129.66 -52.85,-136.86
N$164  (1 unrouted)
  Bottom 0.813: SV3.1 7.37,25.32 10.35,22.34 24.75,22.34 26.55,20.54 26.55,16.63 PCB1.D3
N$165
  Top 0.61: -34.85,-129.46 -34.85,-136.86
N$166
  Top 0.61: -17.05,-145.46 -17.05,-152.66 -16.85,-152.86
N$167
  Bottom 0.813: SV4.1 37.83,25.02 34.55,21.74 30.55,21.74 29.15,20.34 29.15,16.57 PCB1.D2
  Bottom 1.016: 37.83,25.02 36.53,25.02 C11.2
N$168
  Top 0.61: -34.85,-146.06 -34.85,-152.46 -34.65,-152.66
N$169
  Top 0.61: -53.05,-145.46 -53.05,-152.26 -52.65,-152.66
N$170
  Top 0.61: -16.45,-102.86 -16.45,-106.86
N$171
  Top 0.61: -16.65,-114.46 -16.65,-121.26 -17.05,-121.66
N$172
  Top 0.61: 0.95,-129.46 0.95,-136.26 1.35,-136.66
N$173
  Top 0.61: 19.15,-145.46 19.15,-152.46 18.95,-152.66
N$174
  Top 0.61: 19.35,-102.66 19.35,-106.46 19.55,-106.66
N$175
  Top 0.61: 52.35,-102.66 52.35,-106.86
N$176
  Top 0.61: 58.35,-102.66 58.35,-106.46 57.95,-106.86
N$177
  Top 0.61: 37.35,-117.86 37.35,-121.66 37.15,-121.86
N$178
  Top 0.61: 52.35,-117.86 52.35,-121.26 51.95,-121.66
N$179
  Top 0.61: 51.95,-132.66 51.95,-136.06 52.55,-136.66
N$180
  Top 0.61: 58.35,-132.66 58.35,-136.66 58.15,-136.86
N$181
  Top 0.61: 37.35,-145.66 37.35,-152.66 37.15,-152.86
N$182
  Top 0.61: 57.75,-145.66 57.75,-152.26 57.95,-152.46
N$183
  Top 0.61: 73.15,-136.06 73.15,-135.46 68.35,-130.66 68.35,-121.26 75.35,-114.26
N$184
  Top 0.61: 37.35,-136.26 37.35,-130.66
N$186
  pour Bottom (isolate 0.813): 65.15,-86.66 65.35,-86.66 68.15,-89.46 -63.65,-89.46 -66.25,-86.86 -66.85,-86.26 -78.85,-86.26 -79.25,-85.86 -79.25,-84.46 -78.65,-83.86 62.35,-83.86
N$187
  pour Bottom (isolate 0.813): -107.65,57.54 99.55,57.54 99.55,-18.26 -107.65,-18.26
VDD  (6 unrouted)
  Bottom 0.406: -103.85,-94.66 -102.11,-92.92 TR1.3 -97.85,-92.92 | -103.85,-94.66 -103.85,-105.17 | TR3.4 TR3.3 -101.59,-122.92 -103.85,-120.66 | -103.85,-105.17 TR2.3 TR2.4 | -103.85,-120.66 -103.85,-135.66 -101.59,-137.92 TR4.3 TR4.4 | -103.85,-120.66 -103.85,-105.17 | TR1.4 -97.85,-92.92 | -97.85,-92.92 -97.85,-87.86 -96.05,-86.06 -92.25,-86.06 -85.45,-92.86 -85.45,-137.86 -78.04,-145.27 4021CNTRL.16 -78.13,-146.06 -80.05,-146.06 -81.05,-147.06 -81.05,-148.66 -79.85,-149.86 -72.65,-149.86 -65.1,-157.41 ST0.4 | ST0.3 -58.59,-163.4 -56.25,-161.06 -49.44,-161.06 ST1.4 ST1.3 -36.39,-163.4 -35.45,-162.46 -30.04,-162.46 ST2.4 ST2.3 -19.19,-163.4 -18.25,-162.46 -14.25,-162.46 -13.25,-163.46 -11.16,-163.46 ST3.4 ST3.3 0.61,-163.4 1.75,-162.26 4.55,-162.26 5.75,-163.46 6.84,-163.46 ST4.4 ST4.3 17.01,-163.4 18.15,-162.26 23.76,-162.26 ST5.4 ST5.3 35.61,-163.4 36.75,-162.26 39.95,-162.26 41.15,-163.46 42.84,-163.46 ST6.4 ST6.3 52.21,-163.4 53.55,-162.06 58.35,-162.06 59.95,-163.66 60.64,-163.66 ST7.4 ST7.3 | R20.2 84.18,-141.32 MAX7219.19 83.83,-141.38 81.15,-144.06 81.15,-148.66 82.75,-150.26 85.75,-150.26 86.95,-151.46 86.95,-154.86 | 86.95,-154.86 86.95,-160.52 4021STEPS.16 83.97,-163.46 82.35,-163.46 81.15,-164.66 81.15,-171.26 82.35,-172.46 85.95,-172.46 87.15,-171.26 87.15,-170.06 91,-166.21 100.67,-166.21 | 86.95,-154.86 87.35,-154.46 89.35,-154.46 92.4,-151.41 CONTRA.3 98.54,-154.06 | 102.15,-154.06 104.8,-151.41 ACTIVE.3 106.9,-150.4 PLAY.4 PLAY.3 | 102.15,-154.06 98.54,-154.06 | 102.15,-154.06 102.15,-154.17 ACTIVE.4 | 98.54,-154.06 98.54,-155.26 CONTRA.4
  Bottom 0.406: PLAY.3 100.09,-137.92 99.95,-138.06 99.95,-138.26 100.15,-138.26 100.55,-137.86 | -103.85,-94.66 -103.85,-84.46 -102.05,-82.66 62.75,-82.66 71.75,-91.66 71.75,-116.06 74.35,-118.66 89.15,-118.66 93.15,-122.66 93.15,-136.46 94.55,-137.86 100.34,-137.86 PLAY.3
  Bottom 0.61: 100.67,-166.21 100.67,-166.14 103.75,-163.06 110.15,-163.06 112.15,-161.06 118.82,-161.06 8CONMATRIZ.1
  Bottom 0.813: C7.+ 74.09,-7.6 72.35,-5.86 66.21,-5.86 TEMPOT.1 POSITION.1
  Bottom 1.016: C14.1 -46.05,-8.6 | -46.05,-8.6 -38.99,-8.6 | -38.99,-8.6 -37.19,-8.6 IC1.3 -5.11,-5.4 5.95,-16.46 88.35,-16.46 | -38.99,-8.6 -39.05,-8.66 -41.14,-8.66 C13.+ | VDD.1 -46.11,-8.66 -46.05,-8.6 | 8CONCNTRL.1 95.5,14.19 96.15,13.54 96.15,-10.86 90.55,-16.46 82.55,-16.46 76.55,-10.46 C7.+
  pour Bottom (isolate 0.813): -69.65,-160.26 93.15,-160.26 102.75,-169.86 102.75,-174.66 100.35,-177.06 -66.25,-177.06 -69.85,-173.46 -69.85,-160.46
  pour Bottom (isolate 0.813): 74.35,-158.46 74.35,-140.06 78.95,-135.46 88.55,-135.46 93.15,-140.06 100.15,-140.06 103.15,-137.06 105.95,-137.06 105.95,-141.66 108.55,-144.26 108.55,-157.66 106.95,-159.26 75.15,-159.26
  pour Bottom (isolate 0.813): -45.85,-158.66 -45.85,-159.26 -44.45,-160.66 -68.45,-160.66 -71.05,-163.26 -71.05,-167.86 -72.05,-168.86 -75.65,-168.86 -75.65,-161.26 -78.05,-158.86 -78.05,-152.46 -80.25,-150.26 -83.25,-150.26 -83.45,-150.06 -83.45,-145.66 -79.25,-145.66 -75.85,-149.06 -70.25,-149.06 -60.25,-159.06
VSS  (1 unrouted)
  Bottom 0.406: 4021STEPS.8 73.95,-181.26 69.15,-176.46 59.35,-176.46 57.55,-174.66 57.35,-174.86 | 4021CNTRL.8 -85.66,-167.45 -85.65,-167.46